# EAGLE design SparkFun_Soil_Moisture_Sensor (EAGLE 7.2.0)
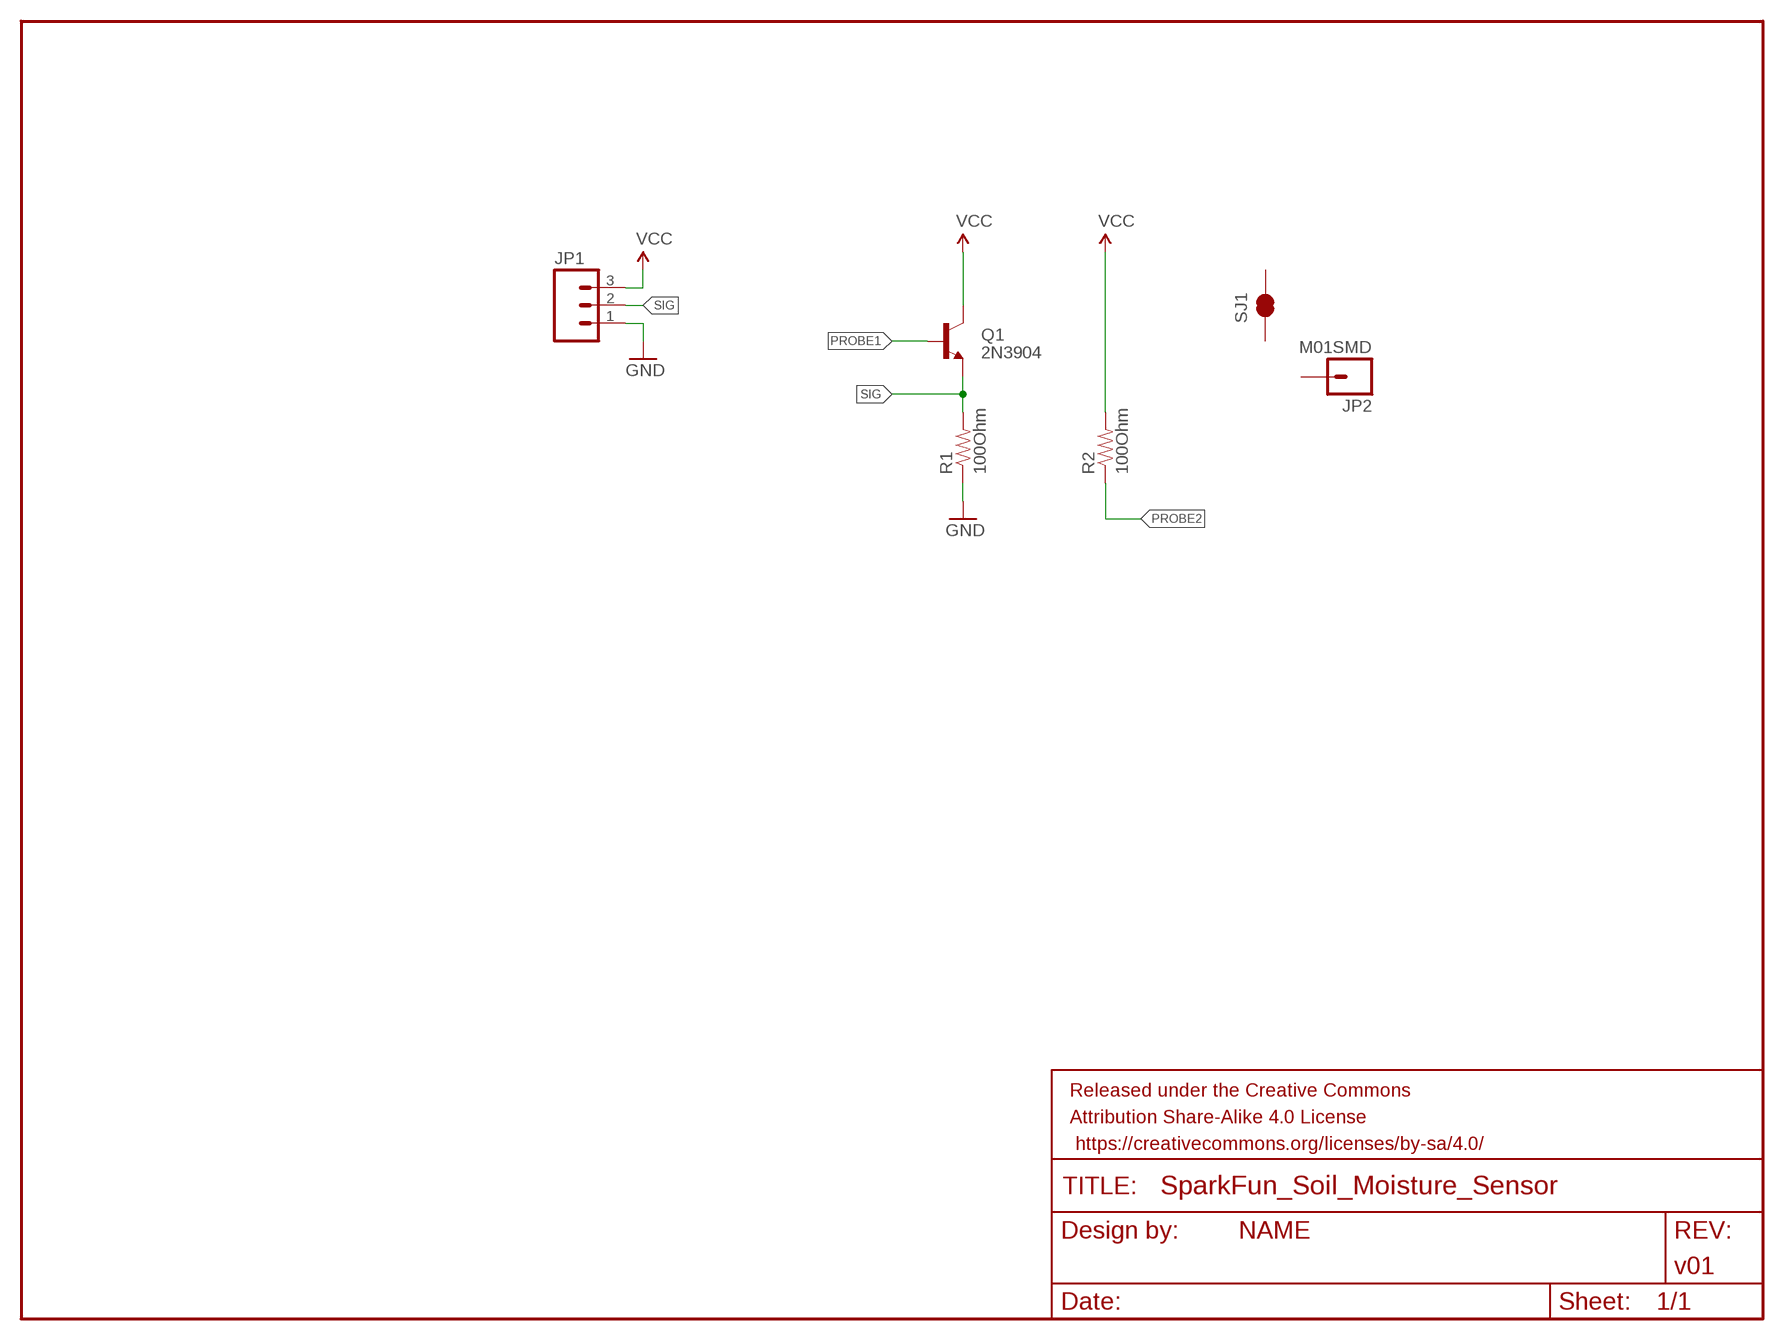
[diagram p0: schematic, sheet 1]

## Parts
FRAME1  FRAME-LETTER  [CREATIVE_COMMONS]
JP1  M03PTH  [1X03]
JP2  M01SMD  [LUXEON-PAD]
Q1  2N3904  TRANSISTOR_NPNMMBT2222A  [SOT23-3]
R1  100Ohm  100OHM-1/4W-5%(0603)  [0603-RES]
R2  100Ohm  100OHM-1/4W-5%(0603)  [0603-RES]
SJ1  JUMPER-PAD-2-NC_BY_TRACE  [PAD-JUMPER-2-NC_BY_TRACE_YES_SILK]

## Nets
GND: JP1.1 R1.1
PROBE1: Q1.1(B)
PROBE2: R2.1
SIG: JP1.2 Q1.2(E) R1.2
VCC: JP1.3 Q1.3(C) R2.2
Unconnected: JP2.P$1 SJ1.1 SJ1.2

## Library data of the parts
FRAME1 = SparkFun-Aesthetics:FRAME-LETTER: Schematic Frame Standard 8.5x11 US Letter frame; DESIGNER: NAME; VERSION: v01
JP1 = SparkFun-Connectors:M03: Header 3 Standard 3-pin 0.1" header. Use with straight break away headers (SKU : PRT-00116), right angle break away headers (PRT-00553), swiss pins (PRT-00743), machine pins (PRT-00117), and female headers (PRT-00115). Molex polarized connector foot print use with SKU : PRT-08232 with associated crimp pins and housings.
JP2 = SparkFun-Connectors:M01: Header 1 Standard 1-pin 0.1" header. Use with straight break away headers (SKU : PRT-00116), right angle break away headers (PRT-00553), swiss pins (PRT-00743), machine pins (PRT-00117), and female headers (PRT-00115).
Q1 = SparkFun-DiscreteSemi:TRANSISTOR_NPN: Generic NPN BJT MMBT2222A - TRANS-08049 (SOT-23, 1A 40V) MPSA42 - TRANS-09116 (SOT-23, 500mA 300V) MMBT5088LT1G - TRANS-11160 (SOT-23, 50 mA 30V) BC547 - COM-08928 <http://www.sparkfun.com/products/8928> (TO-92 45V 100mA) (1.Collector 2.Base 3.Emitter) 2N3904 - COM-00521 <http://www.sparkfun.com/products/521> (TO-92 40V 200mA) (1.Emitter 2.Base 3.Collector) P2N2222A - COM-12852 <http://www.sparkfun.com/products/12852> (TO-92 40V 600mA) (1.Collector 2.Base 3.Emitter); PROD_ID: TRANS-08049; VALUE: MMBT2222A
R1 R2 = SparkFun-Resistors:100OHM-1/4W-5%(0603); PROD_ID: RES-12438; VALUE: 100/.25W
SJ1 = SparkFun-Passives:JUMPER-PAD-2-NC_BY_TRACE

## Board
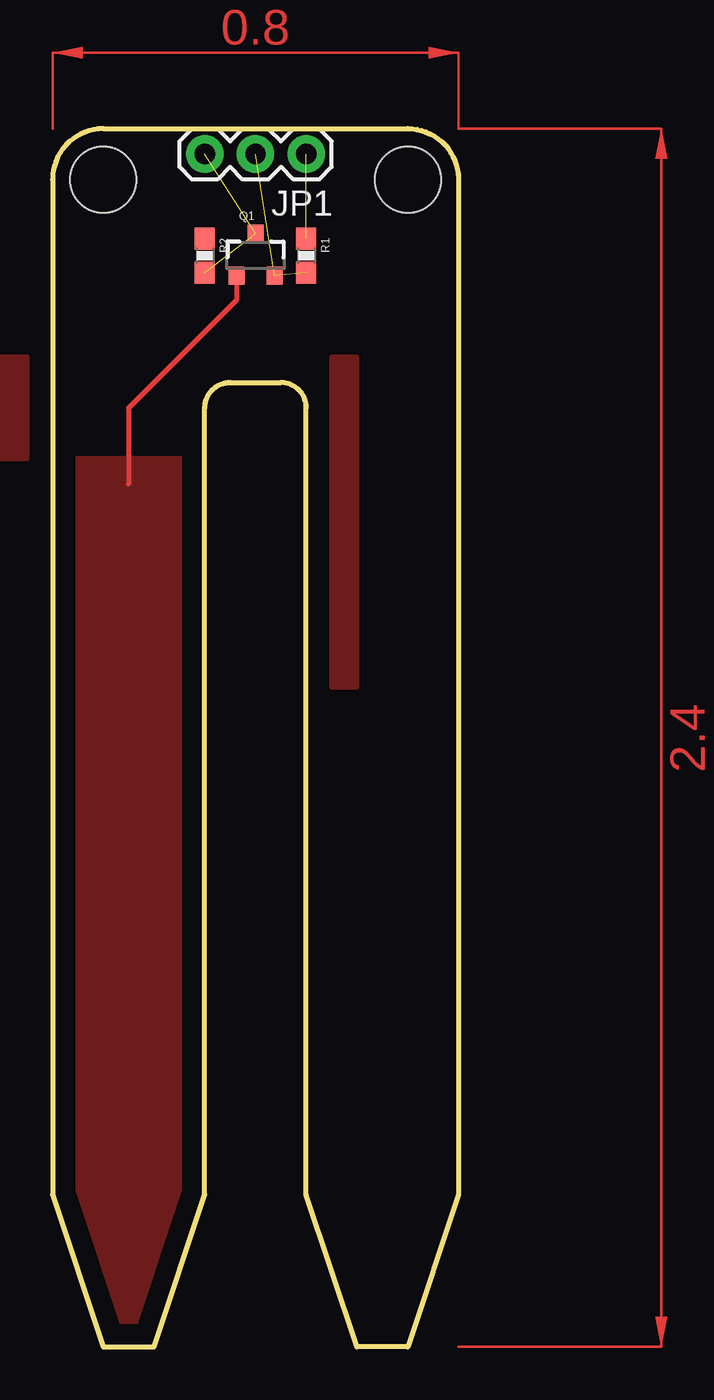
[diagram p1: board, top side]
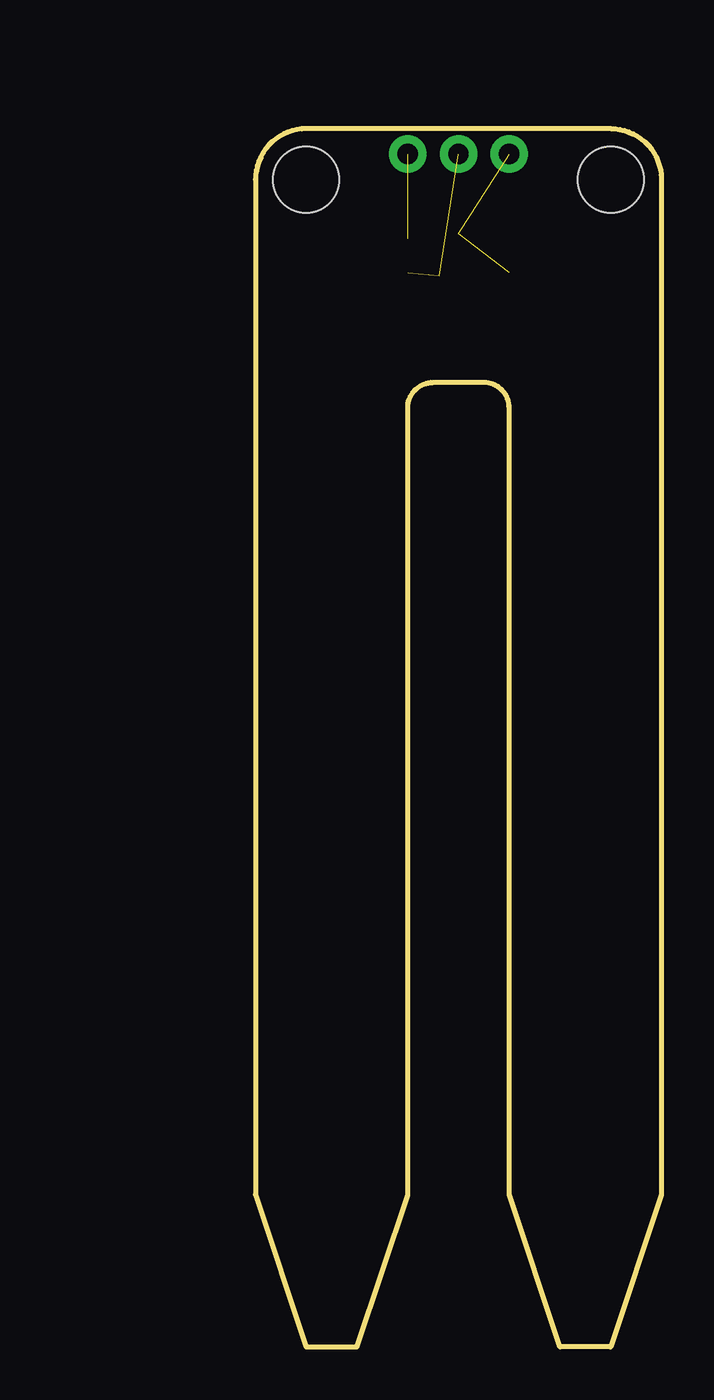
[diagram p2: board, bottom side, seen from below]

Size 20.32 x 60.96 mm. Coordinates in mm from the lower left corner, seen from the top.
Outline: 2.54,60.96 arc90 0,58.42 0,7.62 2.54,0 5.08,0 7.62,7.62 7.62,46.99 arc-90 8.89,48.26 11.43,48.26 arc-90 12.7,46.99 12.7,7.62 15.24,0 17.78,0 20.32,7.62 20.32,58.42 arc90 17.78,60.96 2.54,60.96
Copper layers (1*16): Top 0.035mm / dielectric 1.5mm / Bottom 0.035mm
Design rules "default": minimum track width 10mil, minimum drill 0.6mm, track to track 8mil, track to pad 8mil, pad to pad 8mil, via to via 8mil, smd to smd 8mil, copper to edge 40mil, drill to drill 8mil, minimum pad ring 10mil, minimum via ring 8mil, stop-mask expansion 4mil, vias tented up to drill 0mil, thermal gap 10mil

### Footprints (pad centres in the part's own frame; a part is rotated, then mirrored left to right if it is on the bottom)
1X03 = drill 1.016 pad 1.88: 1 0,0; 2 2.54,0; 3 5.08,0
LUXEON-PAD = smd 3.9 x 2.4: P$1 0,0
SOT23-3 = smd 0.8 x 0.9: 1 -0.95,-1; 2 0.95,-1; 3 0,1.1
0603-RES = smd 1.1 x 1: 1 -0.85,0; 2 0.85,0
PAD-JUMPER-2-NC_BY_TRACE_YES_SILK = smd 0.635 x 1.27: 1 -0.508,0; 2 0.508,0
STAND-OFF = hole 3.302: 0,0

### Placement (x,y rotation side)
FRAME1  17.78,-26.67 0 top  (outside the outline)
JP1  12.7,59.69 180 top
JP2  -8.89,53.34 0 top  (outside the outline)
Q1  10.16,54.61 0 top
R1  12.7,54.61 270 top
R2  7.62,54.61 270 top
SJ1  -11.43,60.96 180 bottom  (outside the outline)
U$1  [STAND-OFF]  17.78,58.42 0 top
U$2  [STAND-OFF]  2.54,58.42 0 top

### Tracks (layer width: path | path; a pad name or v marks a point on that pad's centre or on a via)
GND  (1 unrouted)
  pour Top: -5.08,49.53 -5.08,44.45 -1.27,44.45 -1.27,49.53
PROBE1
  Top 0.254: Q1.1 9.21,52.39 3.81,46.99 3.81,43.18
  pour Top (isolate 0.305): 0,44.45 0,0 7.62,0 7.62,44.45
SIG  (2 unrouted)
VCC  (2 unrouted)
  pour Top: 13.97,49.53 13.97,33.02 15.24,33.02 15.24,49.53
(copper drawn outside any net)
  shapes: Top area x3